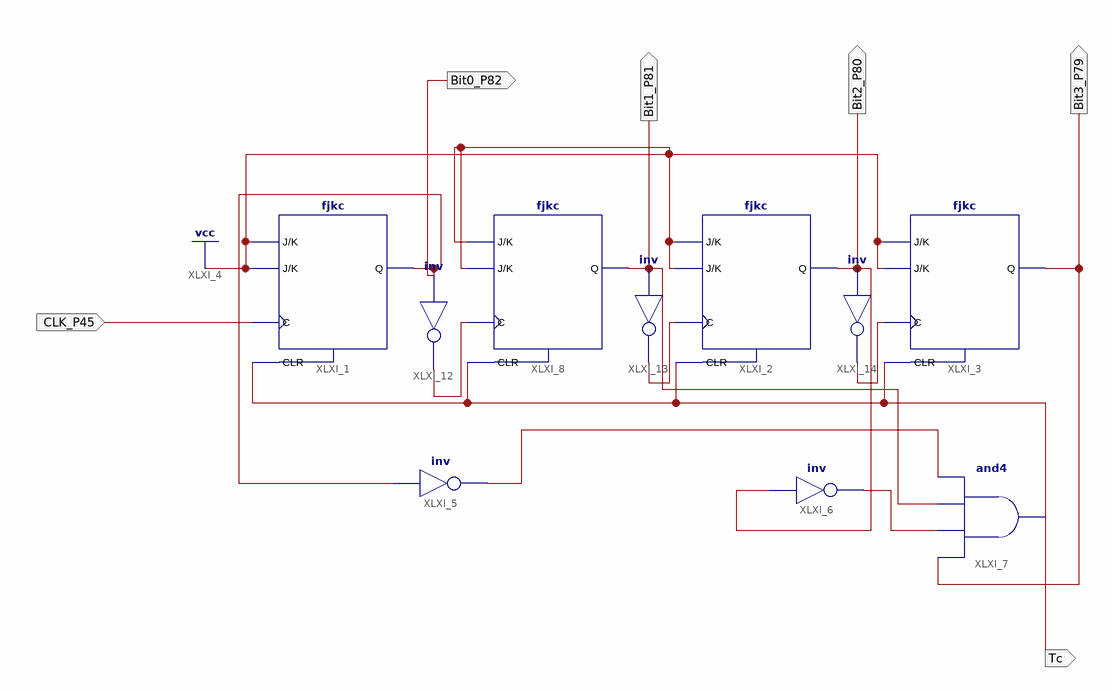
[diagram p0: schematic sheet 1]
// Xilinx ISE schematic count09.sch (spartan6) as structural Verilog: 10 symbols, 6 ports
module count09 (
  input  CLK_P45,
  output Tc,
  output Bit3_P79,
  output Bit0_P82,
  output Bit1_P81,
  output Bit2_P80
);

  wire XLXN_5, XLXN_6, XLXN_20, XLXN_21, XLXN_22;

  fjkc XLXI_1 (.C(CLK_P45), .CLR(Tc), .J(1'b1), .K(1'b1), .Q(Bit0_P82));
  fjkc XLXI_2 (.C(XLXN_21), .CLR(Tc), .J(1'b1), .K(1'b1), .Q(Bit2_P80));
  fjkc XLXI_3 (.C(XLXN_22), .CLR(Tc), .J(1'b1), .K(1'b1), .Q(Bit3_P79));
  not XLXI_5 (XLXN_6, Bit0_P82);
  not XLXI_6 (XLXN_5, Bit2_P80);
  and XLXI_7 (Tc, Bit3_P79, XLXN_5, Bit1_P81, XLXN_6);
  fjkc XLXI_8 (.C(XLXN_20), .CLR(Tc), .J(1'b1), .K(1'b1), .Q(Bit1_P81));
  not XLXI_12 (XLXN_20, Bit0_P82);
  not XLXI_13 (XLXN_21, Bit1_P81);
  not XLXI_14 (XLXN_22, Bit2_P80);

  // Notes on the sheet:
  //   CLOCK_DEDICATED_ROUTE on signal CLK_P45 = TRUE
endmodule
